# Altium project Ref-Board-1.5-WA-r1.0.PrjPcb
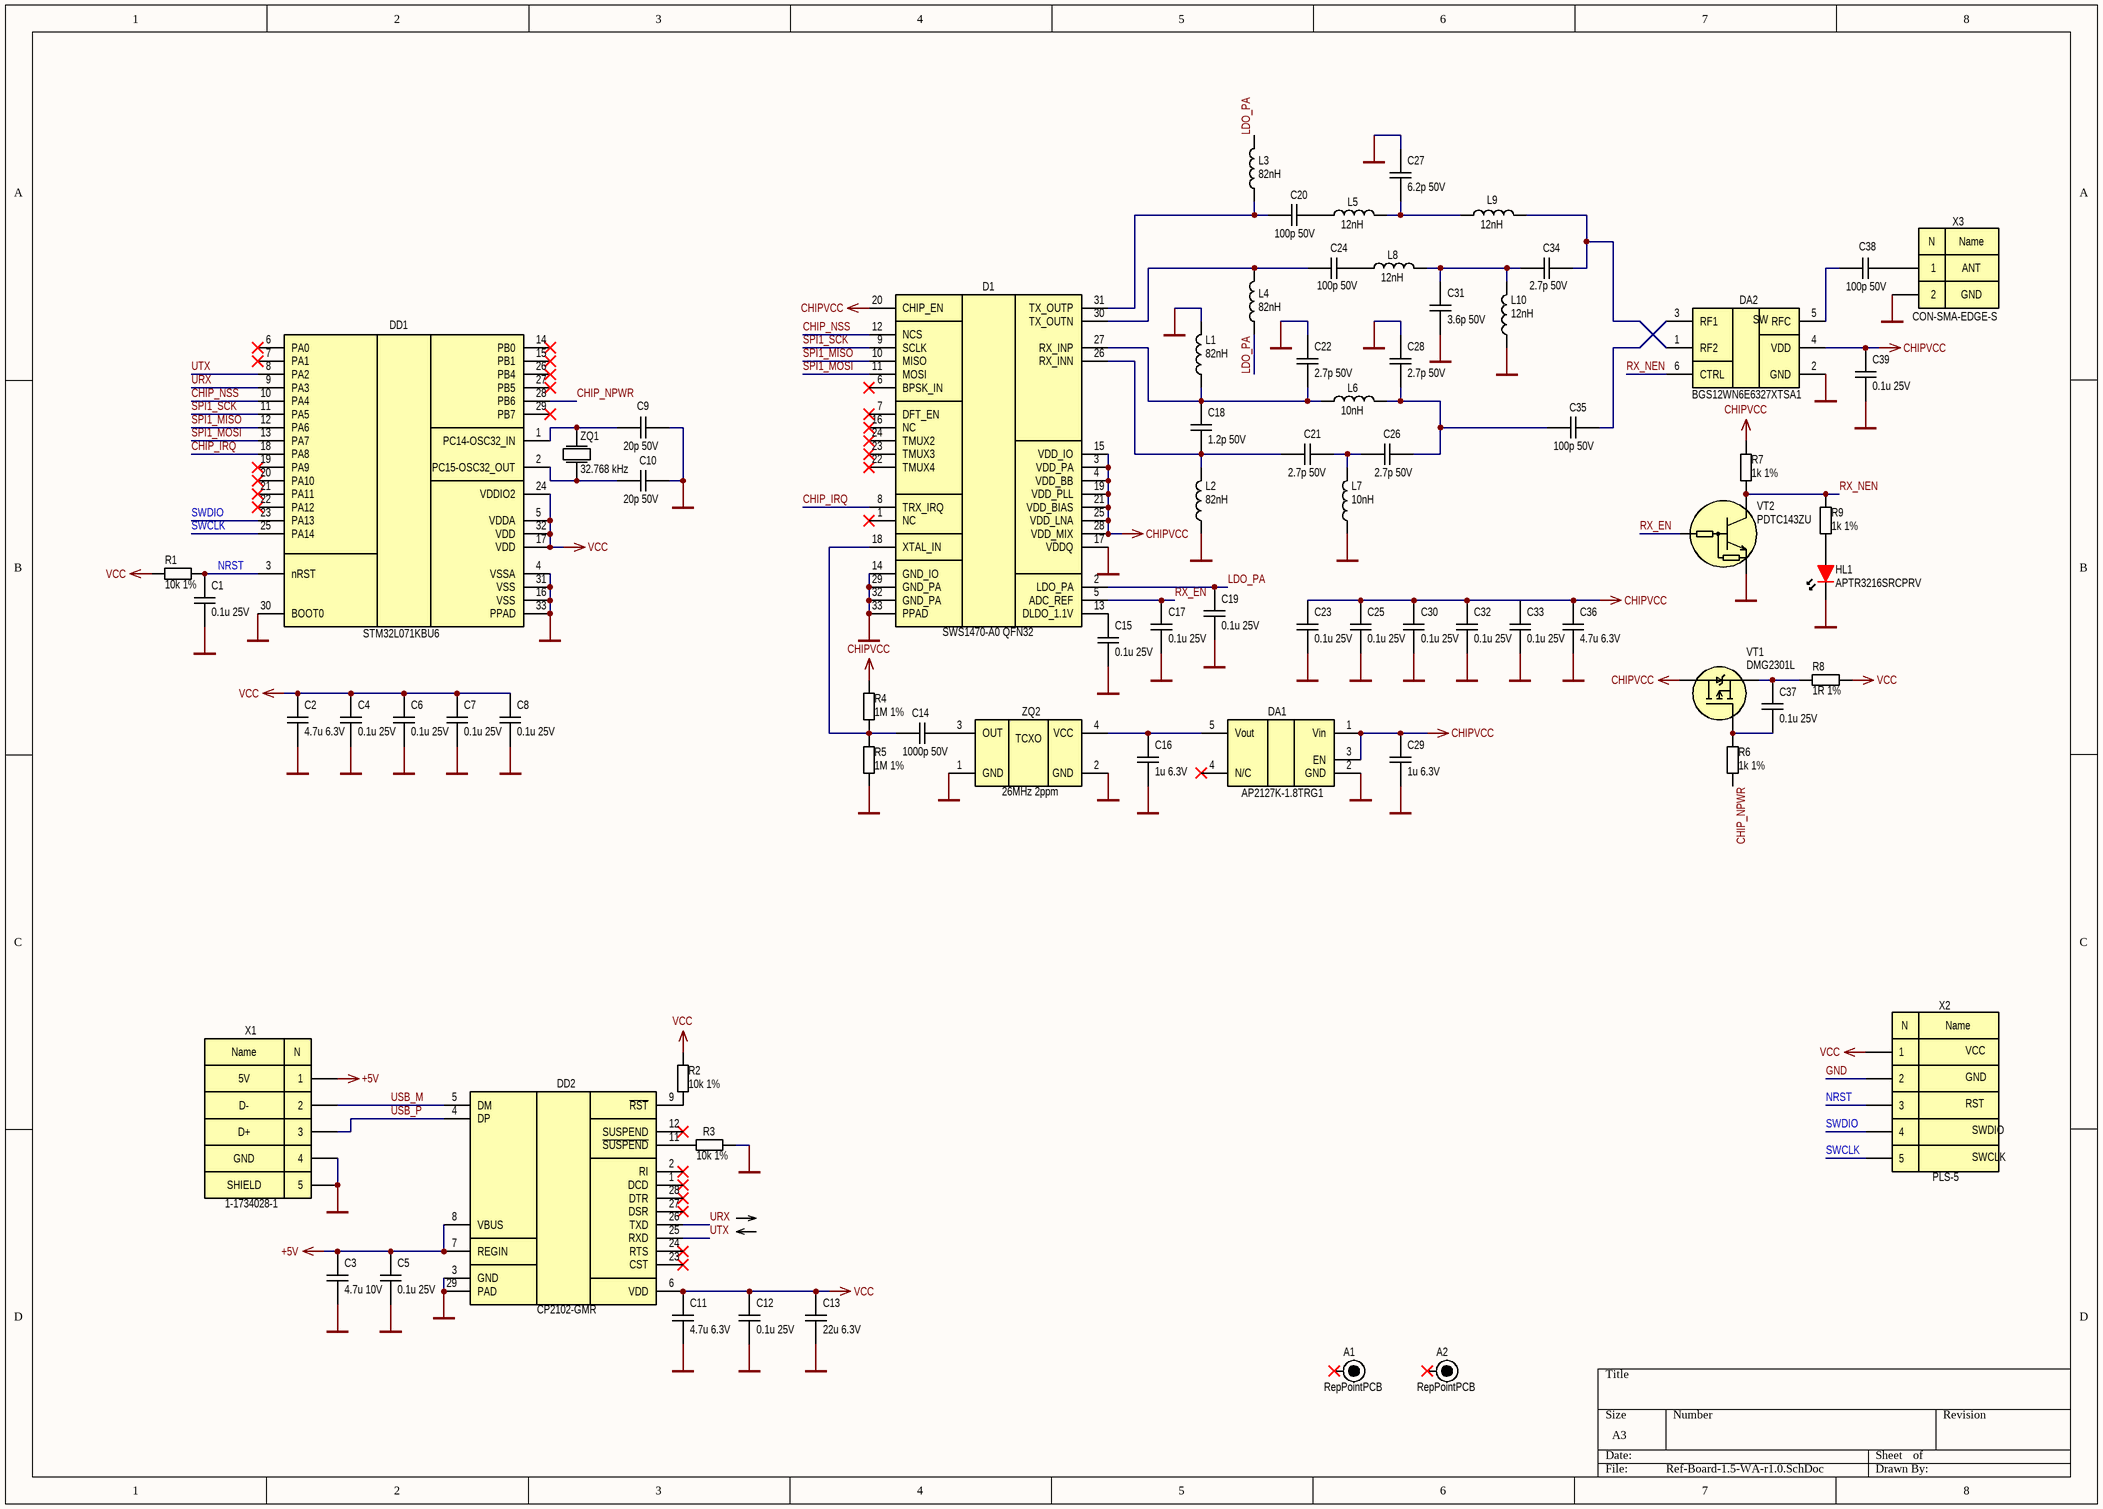
[diagram p0: Ref-Board-1.5-WA-r1.0.SchDoc]
1 sheet, 73 parts. Net scope: global (net labels, ports and power ports of the same name join across sheets).
Board file: Ref-Board-1.5-WA-r1.0.PcbDoc

## Sheet Ref-Board-1.5-WA-r1.0.SchDoc
size A3

### Parts
A1  RepPointPCB  [REPzn]  (no BOM)
A2  RepPointPCB  [REPzn]  (no BOM)
C1  0.1u 25V  [C0402]
C2  4.7u 6.3V  [C0402]
C3  4.7u 10V  [C0603]
C4  0.1u 25V  [C0402]
C5  0.1u 25V  [C0402]
C6  0.1u 25V  [C0402]
C7  0.1u 25V  [C0402]
C8  0.1u 25V  [C0402]
C9  20p 50V  [C0402]
C10  20p 50V  [C0402]
C11  4.7u 6.3V  [C0402]
C12  0.1u 25V  [C0402]
C13  22u 6.3V  [C0603]
C14  1000p 50V  [C0402]
C15  0.1u 25V  [C0402]
C16  1u 6.3V  [C0402]
C17  0.1u 25V  [C0402]
C18  1.2p 50V  [C0402]
C19  0.1u 25V  [C0402]
C20  100p 50V  [C0402]
C21  2.7p 50V  [C0402]
C22  2.7p 50V  [C0402]
C23  0.1u 25V  [C0402]
C24  100p 50V  [C0402]
C25  0.1u 25V  [C0402]
C26  2.7p 50V  [C0402]
C27  6.2p 50V  [C0402]
C28  2.7p 50V  [C0402]
C29  1u 6.3V  [C0402]
C30  0.1u 25V  [C0402]
C31  3.6p 50V  [C0402]
C32  0.1u 25V  [C0402]
C33  0.1u 25V  [C0402]
C34  2.7p 50V  [C0402]
C35  100p 50V  [C0402]
C36  4.7u 6.3V  [C0402]
C37  0.1u 25V  [C0402]
C38  100p 50V  [C0402]
C39  0.1u 25V  [C0402]
D1  SWS1470-A0 QFN32  [QFN32]
DA1  AP2127K-1.8TRG1  [SOT23-5]
DA2  BGS12WN6E6327XTSA1  [6-XFDFN]
DD1  STM32L071KBU6  [UFQFPN32]
DD2  CP2102-GMR  [QFN28]
HL1  APTR3216SRCPRV  [LED1206_RED]  (no BOM)
L1  82nH  [L0402_LQW]
L2  82nH  [L0402_LQW]
L3  82nH  [L0402_LQW]
L4  82nH  [L0402_LQW]
L5  12nH  [L0402_LQW]
L6  10nH  [L0402_LQW]
L7  10nH  [L0402_LQW]
L8  12nH  [L0402_LQW]
L9  12nH  [L0402_LQW]
L10  12nH  [L0402_LQW]
R1  10k 1%  [R0402]
R2  10k 1%  [R0402]
R3  10k 1%  [R0402]
R4  1M 1%  [R0402]
R5  1M 1%  [R0402]
R6  1k 1%  [R0402]
R7  1k 1%  [R0402]  (no BOM)
R8  1R 1%  [R0402]
R9  1k 1%  [R0402]  (no BOM)
VT1  DMG2301L  [SOT23-3L]
VT2  PDTC143ZU  [SOT323]
X1  1-1734028-1  [1-1734028-1]
X2  PLS-5  [PLS-5-2.54-PCB]  (no BOM)
X3  CON-SMA-EDGE-S  [CON-SMA-EDGE-S]
ZQ1  32.768 kHz  [QSMD3.2X1.5X0.8]
ZQ2  26MHz 2ppm  [QSMD2.0x1.6x0.7]

### Nets
+5V: C3.2 C5.2 DD2.7(REGIN) DD2.8(VBUS) X1.1
CHIPVCC: C23.2 C25.2 C29.2 C30.2 C32.2 C33.2 C36.2 C39.2 D1.3(VDD_PA) D1.4(VDD_BB) D1.15(VDD_IO) D1.19(VDD_PLL) D1.20(CHIP_EN) D1.21(VDD_BIAS) D1.25(VDD_LNA) D1.28(VDD_MIX) DA1.1(Vin) DA1.3(EN) DA2.4(VDD) R4.2 R7.1 VT1.3(D)
GND: C1.2 C2.2 C3.1 C4.2 C5.1 C6.2 C7.2 C8.2 C9.2 C10.2 C11.1 C12.1 C13.1 C15.1 C16.1 C17.1 C19.1 C22.1 C23.1 C25.1 C27.1 C28.1 C29.1 C30.1 C31.2 C32.1 C33.1 C36.1 C39.1 D1.14(GND_IO) D1.17(VDDQ) D1.29(GND_PA) D1.32(GND_PA) D1.33(PPAD) DA1.2(GND) DA2.2(GND) DD1.4(VSSA) DD1.16(VSS) DD1.30(BOOT0) DD1.31(VSS) DD1.33(PPAD) DD2.3(GND) DD2.29(PAD) HL1.2 L1.2 L2.1 L7.1 L10.1 R3.1 R5.1 VT2.2 X1.4 X1.5 X2.2 X3.2 ZQ2.1(GND) ZQ2.2(GND)
VCC: C2.1 C4.1 C6.1 C7.1 C8.1 C11.2 C12.2 C13.2 DD1.5(VDDA) DD1.17(VDD) DD1.24(VDDIO2) DD1.32(VDD) DD2.6(VDD) R1.1 R2.2 R8.1 X2.1
CHIP_IRQ: D1.8(TRX_IRQ) DD1.18(PA8)
CHIP_NPWR: DD1.28(PB6) R6.1
CHIP_NSS: D1.12(NCS) DD1.10(PA4)
LDO_PA: C19.2 D1.2(LDO_PA) L3.2 L4.1
NRST: C1.1 DD1.3(nRST) R1.2 X2.3
RX_EN: C17.2 D1.5(ADC_REF) VT2.1
RX_NEN: DA2.6(CTRL) R7.2 R9.1 VT2.3
SPI1_MISO: D1.10(MISO) DD1.12(PA6)
SPI1_MOSI: D1.11(MOSI) DD1.13(PA7)
SPI1_SCK: D1.9(SCLK) DD1.11(PA5)
SWCLK: DD1.25(PA14) X2.5
SWDIO: DD1.23(PA13) X2.4
URX: DD1.9(PA3) DD2.26(TXD)
USB_M: DD2.5(DM) X1.2
USB_P: DD2.4(DP) X1.3
UTX: DD1.8(PA2) DD2.25(RXD)
NetC9_1: C9.1 DD1.1(PC14-OSC32_IN) ZQ1.1
NetC10_1: C10.1 DD1.2(PC15-OSC32_OUT) ZQ1.3
NetC14_1: C14.1 ZQ2.3(OUT)
NetC14_2: C14.2 D1.18(XTAL_IN) R4.1 R5.2
NetC15_2: C15.2 D1.13(DLDO_1.1V)
NetC16_2: C16.2 DA1.5(Vout) ZQ2.4(VCC)
NetC18_1: C18.1 C22.2 D1.27(RX_INP) L1.1 L6.1
NetC18_2: C18.2 C21.1 D1.26(RX_INN) L2.2
NetC20_1: C20.1 D1.31(TX_OUTP) L3.1
NetC20_2: C20.2 L5.1
NetC21_2: C21.2 C26.1 L7.2
NetC24_1: C24.1 D1.30(TX_OUTN) L4.2
NetC24_2: C24.2 L8.1
NetC26_2: C26.2 C28.2 C35.1 L6.2
NetC27_2: C27.2 L5.2 L9.1
NetC31_1: C31.1 C34.1 L8.2 L10.2
NetC34_2: C34.2 DA2.1(RF2) L9.2
NetC35_2: C35.2 DA2.3(RF1)
NetC37_1: C37.1 R6.2 VT1.1(G)
NetC37_2: C37.2 R8.2 VT1.2(S)
NetC38_1: C38.1 DA2.5(RFC)
NetC38_2: C38.2 X3.1
NetDD2_9: DD2.9(~{RST}) R2.1
NetDD2_11: DD2.11(~{SUSPEND}) R3.2
NetHL1_1: HL1.1 R9.2

Not connected (* = marked no-connect by the designer): A1 1*; A2 1*; D1 1(NC)* 6(BPSK_IN)* 7(DFT_EN)* 16(NC)* 22(TMUX4)* 23(TMUX3)* 24(TMUX2)*; DA1 4(N/C)*; DD1 6(PA0)* 7(PA1)* 14(PB0)* 15(PB1)* 19(PA9)* 20(PA10)* 21(PA11)* 22(PA12)* 26(PB4)* 27(PB5)* 29(PB7)*; DD2 1(DCD)* 2(RI)* 12(SUSPEND)* 23(CST)* 24(RTS)* 27(DSR)* 28(DTR)*

### Notes on the sheet
- VCC
- RST
- GND
- (near X2) SWDIO
- (near X2) SWCLK
- (in symbol 1-1734028-1) Name; N; 5V; D-; D+; GND; SHIELD
- (in symbol BGS12WN6E6327XTSA1) SW
- (in symbol CON-SMA-EDGE-S) N; Name; ANT; GND
- (in symbol NT2016SA-26.000000MHZ-NBG2) TCXO
- (in symbol PLS-5) N; Name

### Library data of the parts
A1 A2 = RepPointCircD1.0: Repere point d=0.5mm, D=1mm
C1 C4-C8 C12 C15 C17 C19 C23 C25 C30 C32 C33 C37 C39 = CC0402KRX7R8BB104: CAP CER 0.1UF 25V X7R 0402; PartNumber: CC0402KRX7R8BB104
C2 C11 C36 = CC0402KRX5R5BB475: CAP CER 4.7UF 6.3V X5R 0402; PartNumber: CC0402KRX5R5BB475
C3 = CC0603KRX5R6BB475: CERCAP 4.7/10V 0603 KX5R; PartNumber: CC0603KRX5R6BB475
C9 C10 = CC0402JRNPO9BN200: CAP CER 20PF 50V C0G/NPO 0402; PartNumber: CC0402JRNPO9BN200
C13 = GRM188R60J226MEA0J: CAP CER 22UF 6.3V X5R 0603; PartNumber: GRM188R60J226MEA0J
C14 = CC0402JRX7R9BB102: CAP CER 1000PF 50V X7R 0402; PartNumber: CC0402JRX7R9BB102
C16 C29 = CC0402KRX5R5BB105: CAP CER 1UF 6.3V X5R 0402; PartNumber: CC0402KRX5R5BB105
C18 = CC0402BRNPO9BN1R2: CAP CER 1.2PF 50V C0G/NPO 0402; PartNumber: CC0402BRNPO9BN1R2
C20 C24 C35 C38 = CC0402JRNPO9BN101: CAP CER 100PF 50V C0G/NPO 0402; PartNumber: CC0402JRNPO9BN101
C21 C22 C26 C28 C34 = CC0402BRNPO9BN2R7: CAP CER 2.7PF 50V C0G/NPO 0402; PartNumber: CC0402BRNPO9BN2R7
C27 = CC0402CRNPO9BN6R2: CAP CER 6.2PF 50V NPO 0402; PartNumber: CC0402CRNPO9BN6R2
C31 = CC0402BRNPO9BN3R6: CAP CER 3.6PF 50V NPO 0402; PartNumber: CC0402BRNPO9BN3R6
D1 = SWS1470-A0 QFN32: Waviot NB-Fi RF Transceiver QFN32; PartNumber: SWS1470-A0 QFN32
DA1 = AP2127K-1.8TRG1: LDO Voltage Regulators 1.8V 80mA CMOS LDO w/Enable; PartNumber: AP2127K-1.8TRG1
DA2 = BGS12WN6E6327XTSA1: RF Switch IC WLAN SPDT 50Ohm PG-TSNP-6-10; PartNumber: BGS12WN6E6327XTSA1
DD1 = STM32L071KBU6: ARM® Cortex®-M0+ STM32L0 Microcontroller IC 32-Bit 32MHz 128KB (128K x 8) FLASH 32-UFQFPN (5x5); PartNumber: STM32L071KBU6
DD2 = CP2102-GMR: IC USB-TO-UART BRIDGE 28VQFN; PartNumber: CP2102-GMR
HL1 = APTR3216SRCPRV: Red 640nm LED Indication - Discrete 1.85V 1206; PartNumber: APTR3216SRCPRV
L1-L4 = LQW15AN82NG00D: FIXED IND 82NH 130MA 2.24 OHM; PartNumber: LQW15AN82NG00D
L5 L8-L10 = LQW15AN12NG00D: FIXED IND 12NH 500MA 140 MOHM; PartNumber: LQW15AN12NG00D
L6 L7 = LQW15AN10NG00D: FIXED IND 10NH 500MA 170 MOHM; PartNumber: LQW15AN10NG00D
R1-R3 = RC0402FR-0710KL: RES SMD 10K OHM 1% 1/16W 0402; PartNumber: RC0402FR-0710KL
R4 R5 = RC0402FR-071ML: RES SMD 1M OHM 1% 1/16W 0402; PartNumber: RC0402FR-071ML
R6 R7 R9 = RC0402FR-071KL: RES SMD 1K OHM 1% 1/16W 0402; PartNumber: RC0402FR-071KL
R8 = RC0402FR-071RL: RES SMD 1 OHM 1% 1/16W 0402; PartNumber: RC0402FR-071RL
VT1 = DMG2301L: MOSFET P-CH 20V 3A SOT23; PartNumber: DMG2301L
VT2 = PDTC143ZU: TRANS PREBIAS NPN 200MW SOT323; PartNumber: PDTC143ZU
X1 = 1-1734028-1: USB-A (USB TYPE-A) USB 2.0 Plug; PartNumber: 1-1734028-1
X2 = PLS-5: PLS-5-2.54; PartNumber: PLS-5
X3 = CON-SMA-EDGE-S: CONN SMA JACK STR EDGE MNT; PartNumber: CON-SMA-EDGE-S
ZQ1 = NX3215SA-32.768K-EXS00A: CRYSTAL 32.768KHZ 12.5PF SMD; PartNumber: NX3215SA-32.768K-EXS00A
ZQ2 = NT2016SA-26.000000MHZ-NBG2: TCXO Oscillator 4-pin; PartNumber: NT2016SA-26.000000MHZ-NBG2